# EAGLE design pedometer (EAGLE 9.6.2)
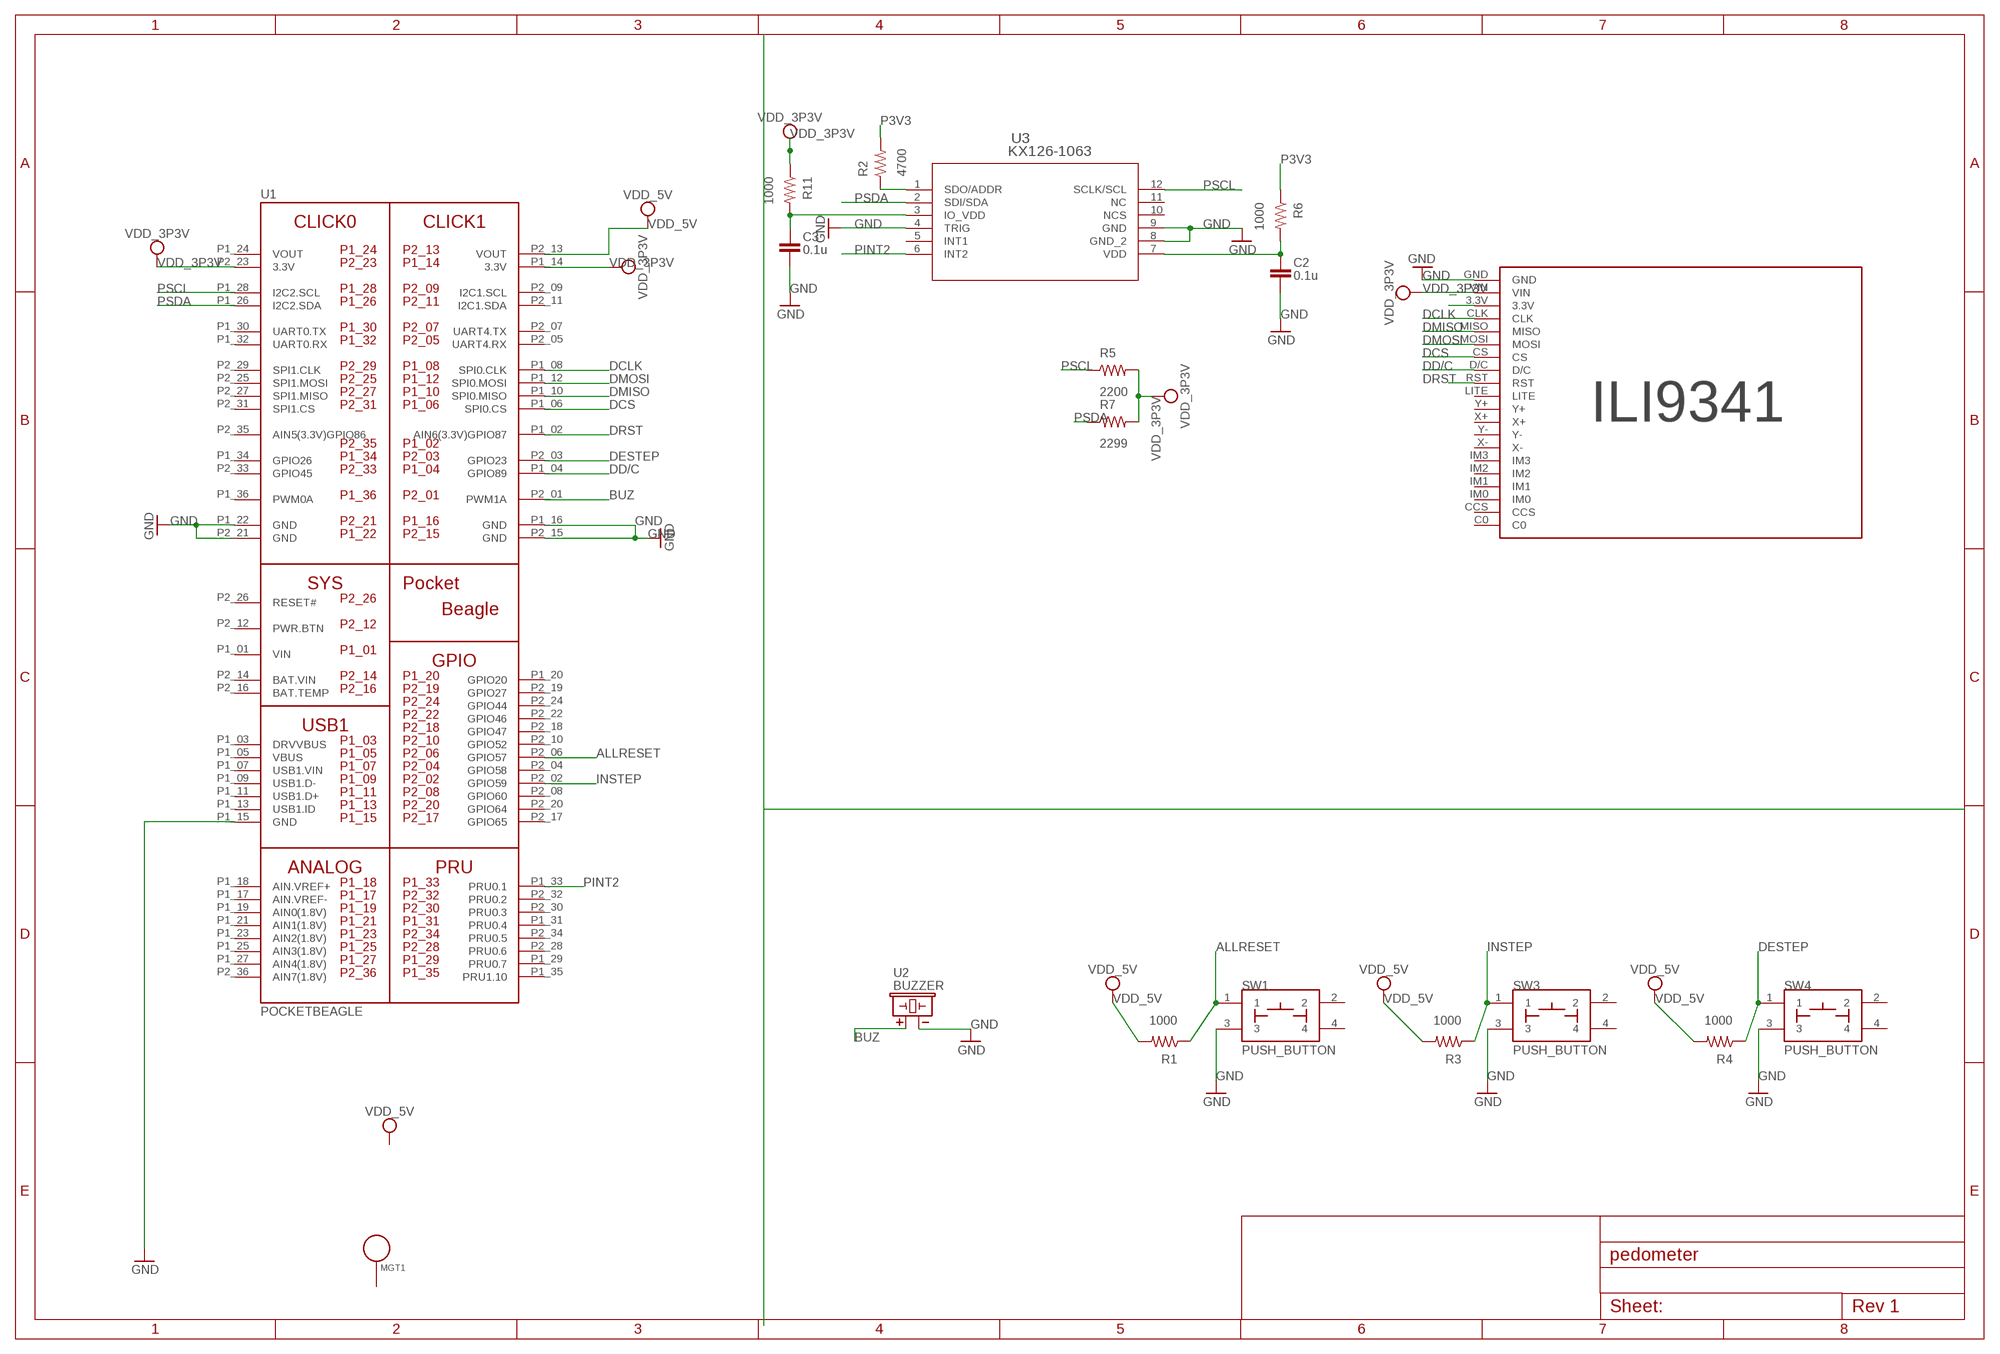
[diagram p0: schematic, sheet 1]

## Parts
B2  ILI9341  [ILI9341]
C2  0.1u  C_C0402  [C0402]
C3  0.1u  C_C0402  [C0402]
MGT1  MOUNTING_HOLE  [MOUNTING_HOLE]
R1  1000  R_R0805  [R0805]
R2  4700  R_R0603  [R0603]
R3  1000  R_R0805  [R0805]
R4  1000  R_R0805  [R0805]
R5  2200  R_R0603  [R0603]
R6  1000  R_R0603  [R0603]
R7  2299  R_R0603  [R0603]
R11  1000  R_R0603  [R0603]
SW1  PUSH_BUTTON  [BUTTON_12.5MM]
SW3  PUSH_BUTTON  [BUTTON_12.5MM]
SW4  PUSH_BUTTON  [BUTTON_12.5MM]
U1  POCKETBEAGLE  [POCKETBEAGLE]
U2  BUZZER  [BUZZER_6.5MM]
U3  KX126-1063  [LGA12_2X2X0P9_KNX]

## Nets
ALLRESET: R1.1 SW1.1 U1.P2_06(GPIO57)
BUZ: U1.P2_01(PWM1A) U2.+
DCLK: B2.CLK U1.P1_08(SPI0.CLK)
DCS: B2.CS U1.P1_06(SPI0.CS)
DD/C: B2.D/C U1.P1_04(GPIO89)
DESTEP: R4.1 SW4.1 U1.P2_03(GPIO23)
DMISO: B2.MISO U1.P1_10(SPI0.MISO)
DMOSI: B2.MOSI U1.P1_12(SPI0.MOSI)
DRST: B2.RST U1.P1_02(AIN6(3.3V)GPIO87)
GND: B2.GND C2.2 C3.2 SW1.3 SW3.3 SW4.3 U1.P1_15(GND) U1.P1_16(GND) U1.P1_22(GND) U1.P2_15(GND) U1.P2_21(GND) U2.- U3.4(TRIG) U3.8(GND_2) U3.9(GND)
INSTEP: R3.1 SW3.1 U1.P2_02(GPIO59)
N$2: C2.1 R6.2 U3.7(VDD)
N$3: C3.1 R11.2 U3.3(IO_VDD)
N$4: B2.3.3V
N$5: R2.1 U3.1(SDO/ADDR)
P3V3: R2.2 R6.1
PINT2: U1.P1_33(PRU0.1) U3.6(INT2)
PSCL: R5.1 U1.P1_28(I2C2.SCL) U3.12(SCLK/SCL)
PSDA: R7.1 U1.P1_26(I2C2.SDA) U3.2(SDI/SDA)
VDD_3P3V: B2.VIN R5.2 R7.2 R11.1 U1.P1_14(3.3V) U1.P2_23(3.3V)
VDD_5V: R1.2 R3.2 R4.2 U1.P2_13(VOUT)
Unconnected: B2.C0 B2.CCS B2.IM0 B2.IM1 B2.IM2 B2.IM3 B2.LITE B2.X+ B2.X- B2.Y+ B2.Y- MGT1.P$1 SW1.2 SW1.4 SW3.2 SW3.4 SW4.2 SW4.4 U1.P1_03(DRVVBUS) U1.P1_05(VBUS) U1.P1_07(USB1.VIN) U1.P1_09(USB1.D-) U1.P1_11(USB1.D+) U1.P1_13(USB1.ID) U1.P1_17(AIN.VREF-) U1.P1_18(AIN.VREF+) U1.P1_19(AIN0(1.8V)) U1.P1_20(GPIO20) U1.P1_21(AIN1(1.8V)) U1.P1_23(AIN2(1.8V)) U1.P1_25(AIN3(1.8V)) U1.P1_27(AIN4(1.8V)) U1.P1_29(PRU0.7) U1.P1_30(UART0.TX) U1.P1_31(PRU0.4) U1.P1_32(UART0.RX) U1.P1_34(GPIO26) U1.P1_35(PRU1.10) U1.P1_36(PWM0A) U1.P2_04(GPIO58) U1.P2_05(UART4.RX) U1.P2_07(UART4.TX) U1.P2_08(GPIO60) U1.P2_09(I2C1.SCL) U1.P2_10(GPIO52) U1.P2_11(I2C1.SDA) U1.P2_12(PWR.BTN) U1.P2_16(BAT.TEMP) U1.P2_17(GPIO65) U1.P2_18(GPIO47) U1.P2_19(GPIO27) U1.P2_20(GPIO64) U1.P2_22(GPIO46) U1.P2_24(GPIO44) U1.P2_25(SPI1.MOSI) U1.P2_26(RESET#) U1.P2_27(SPI1.MISO) U1.P2_28(PRU0.6) U1.P2_29(SPI1.CLK) U1.P2_30(PRU0.3) U1.P2_31(SPI1.CS) U1.P2_32(PRU0.2) U1.P2_33(GPIO45) U1.P2_34(PRU0.5) U1.P2_35(AIN5(3.3V)GPIO86) U1.P2_36(AIN7(1.8V)) U3.5(INT1) U3.10(NCS) U3.11(NC)

## Power pins joined to a net without a drawn wire
BAT.VIN: U1.P2_14(BAT.VIN)
VIN: U1.P1_01(VIN)
VOUT: U1.P1_24(VOUT)

## Library data of the parts
B2 = Juan_pedometer:ILI9341: ILI9341 LCD based on the 2.8" Adafruit product
C2 C3 = Juan_pedometer:C_: Capacitor SMD. Sizes: 0402, 0603 & 0805
MGT1 = Juan_pedometer:MOUNTING_HOLE: Chassis Mounting Hole w/GND connection ability
R1-R7 R11 = Juan_pedometer:R_: RESISTOR, American symbol
SW1 SW3 SW4 = Juan_pedometer:PUSH_BUTTON
U1 = Juan_pedometer:POCKETBEAGLE
U2 = Juan_pedometer:BUZZER: CEM-1203 Buzzer
U3 = Juan_pedometer:KX126-1063; COPYRIGHT: Copyright (C) 2021 Ultra Librarian. All rights reserved.; DIGI-KEY_PART_NUMBER_1: 1191-1058-2-ND; DIGI-KEY_PART_NUMBER_2: 1191-1058-1-ND; DIGI-KEY_PART_NUMBER_3: 1191-1058-6-ND; MANUFACTURER_PART_NUMBER: KX126-1063; MFR_NAME: Kionix

## Board
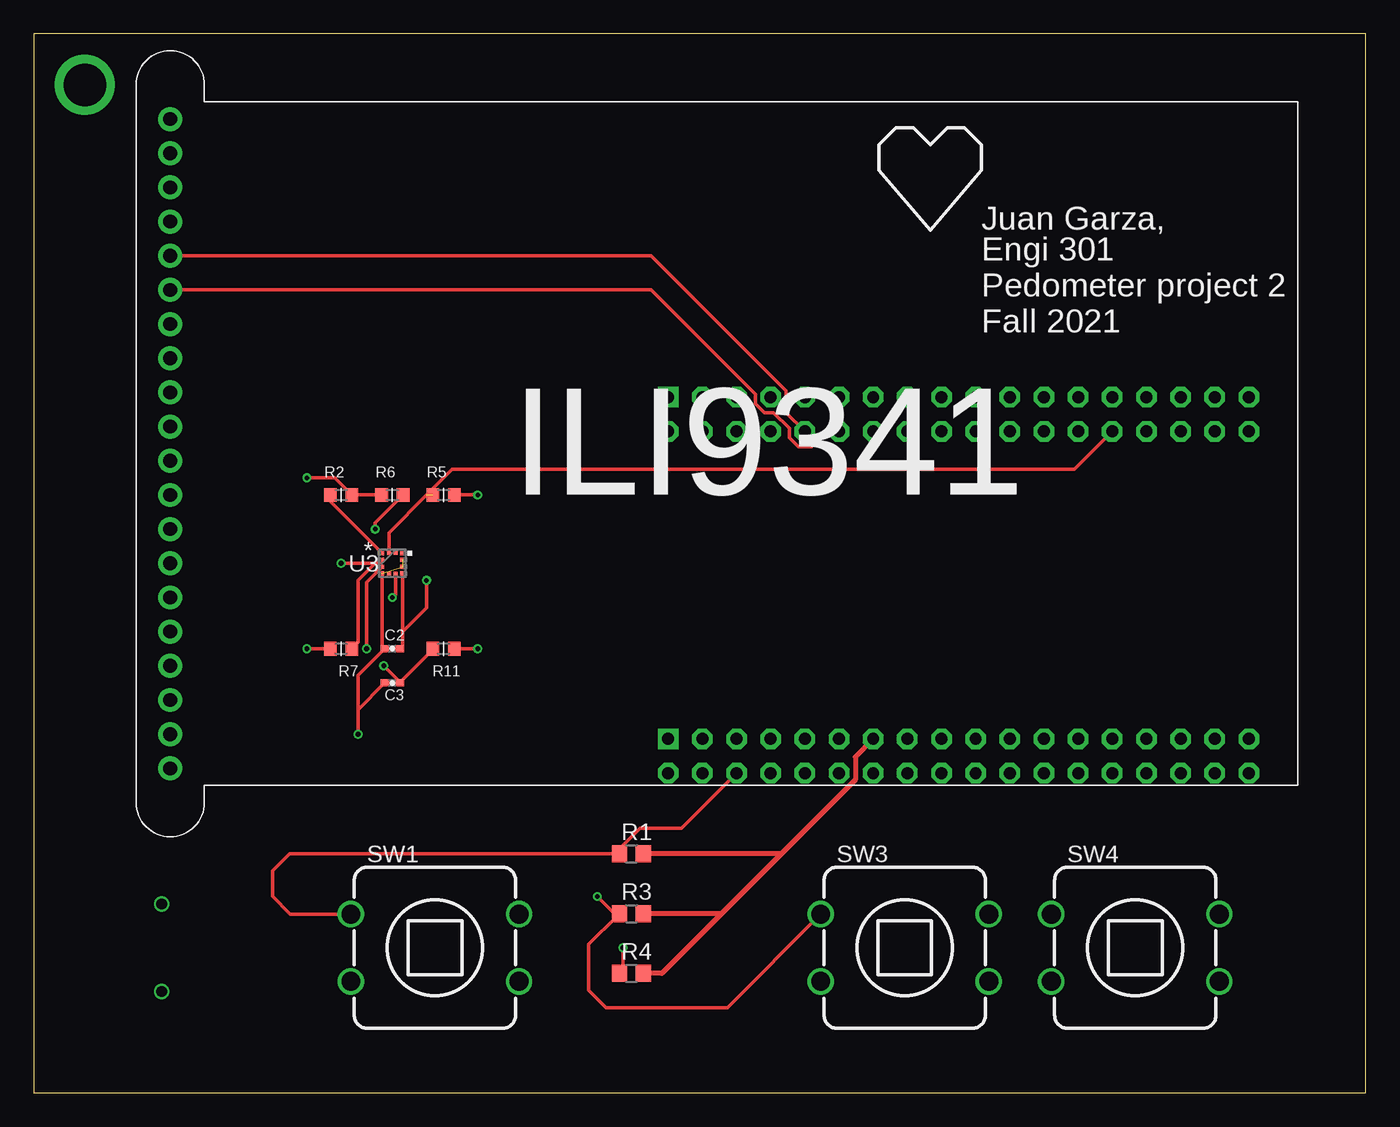
[diagram p1: board, top side]
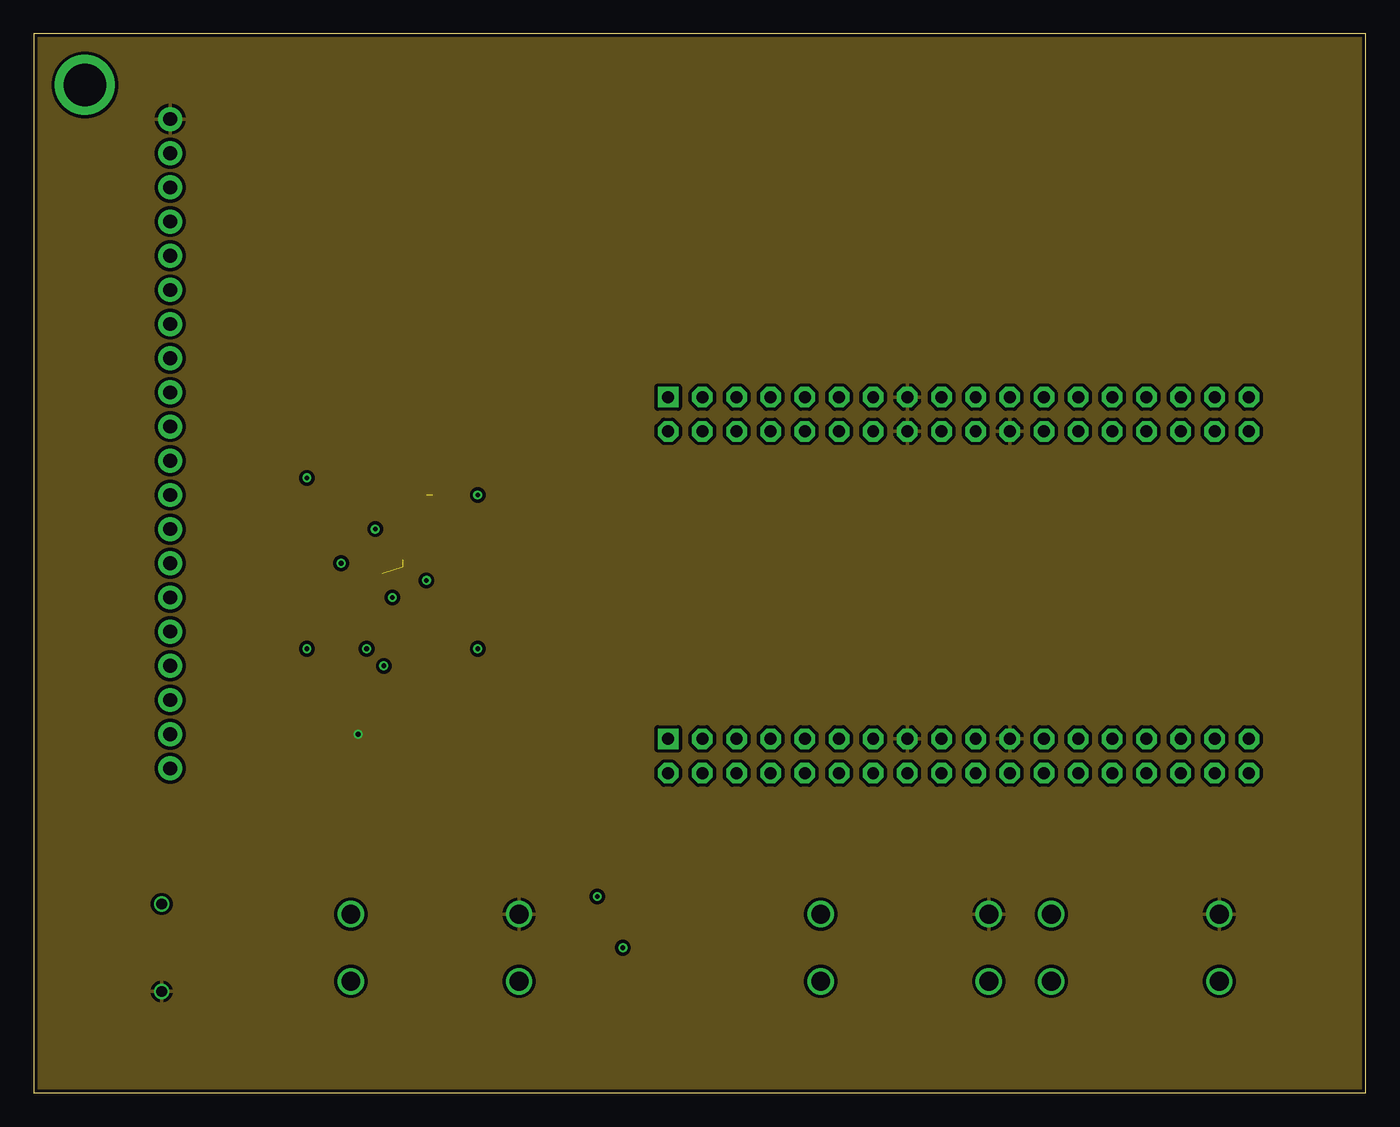
[diagram p2: board, inner layer Route2]
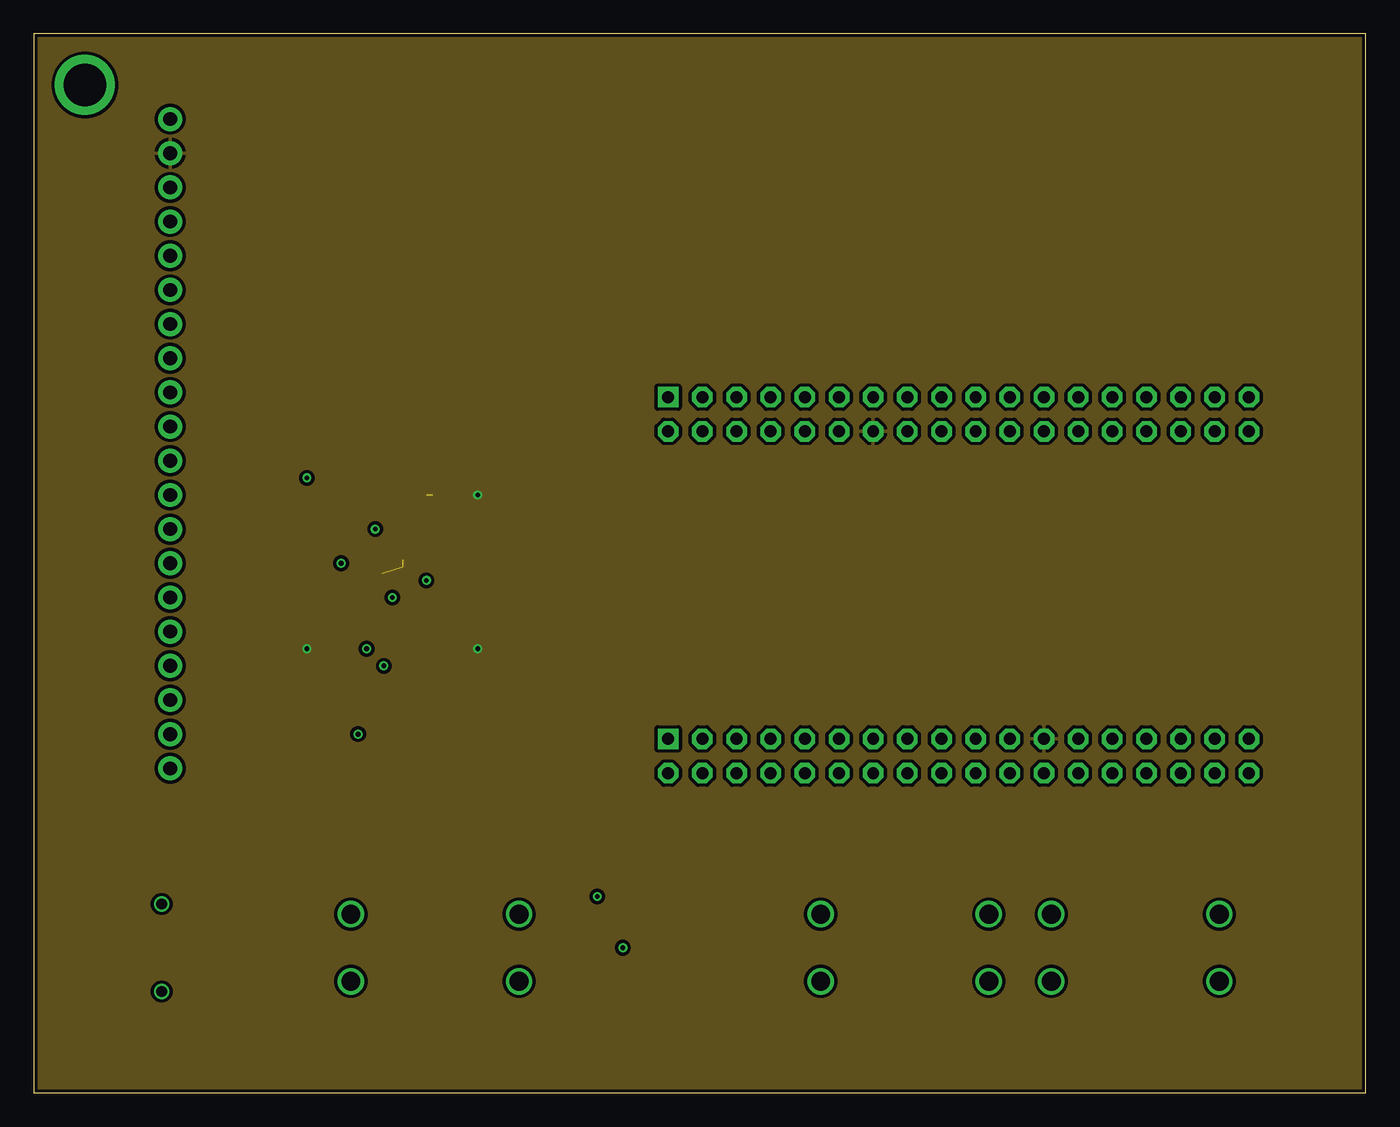
[diagram p3: board, inner layer Route15]
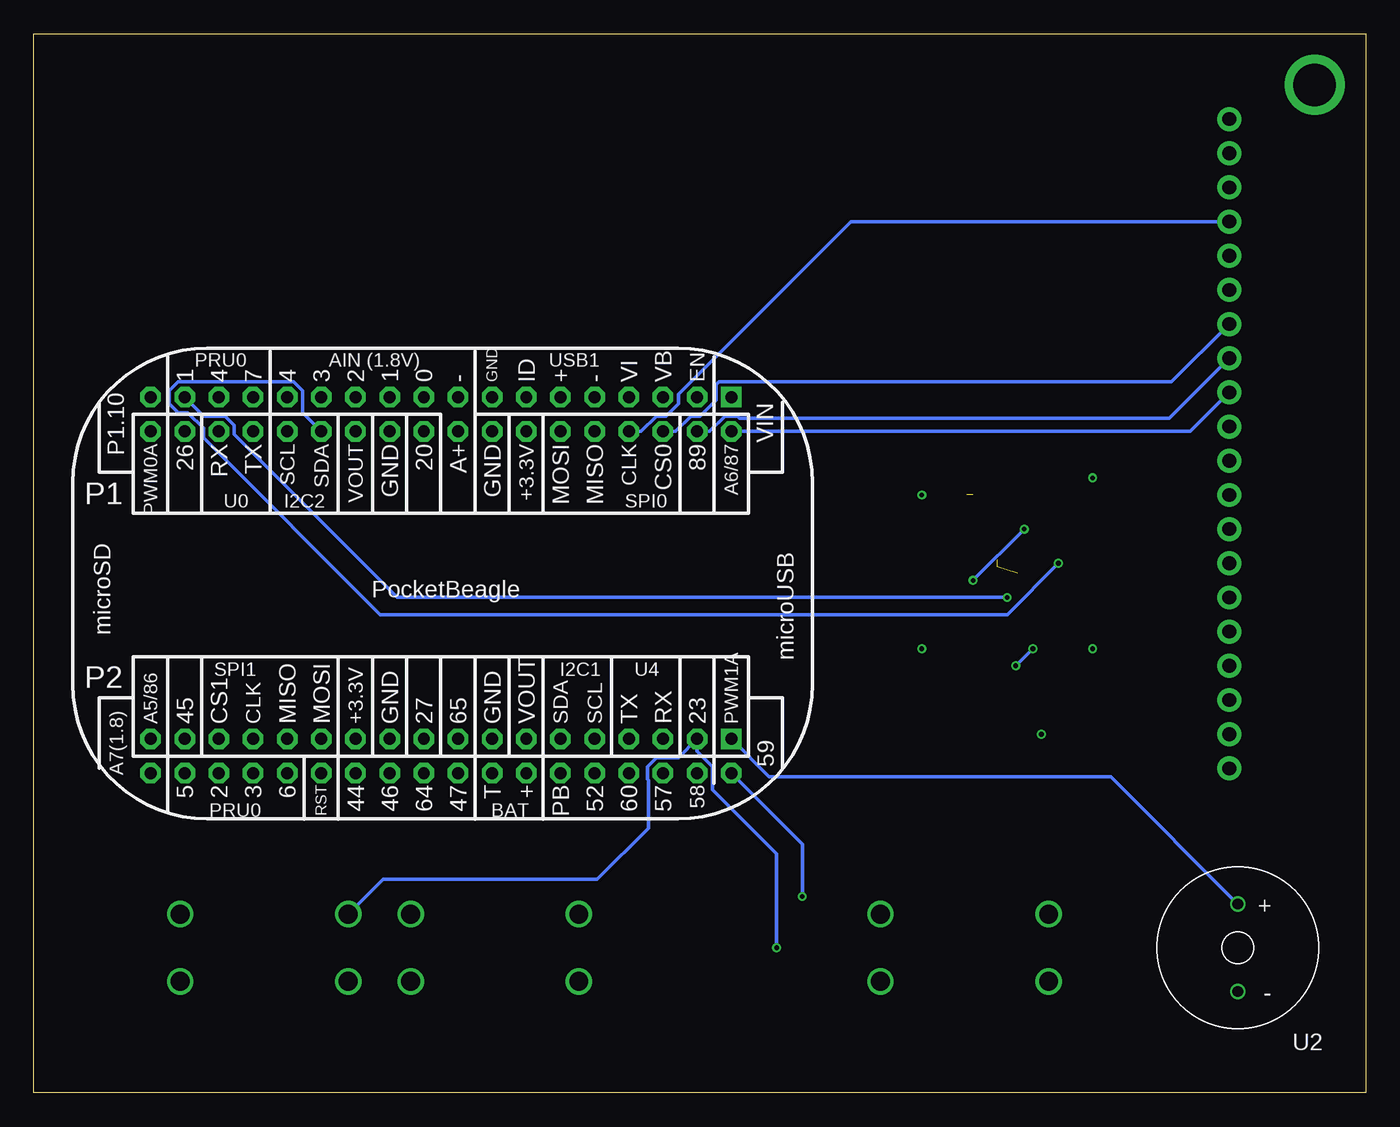
[diagram p4: board, bottom side, seen from below]

Size 99.06 x 78.74 mm. Coordinates in mm from the lower left corner, seen from the top.
Outline: 0,0 99.06,0 99.06,78.74 0,78.74 0,0
Copper layers (1*2*15*16): Top 0.035mm / dielectric 0.23mm / Route2 0.035mm / dielectric 0.93mm / Route15 0.035mm / dielectric 0.23mm / Bottom 0.035mm
Design rules "ENGI301_4lyr *": minimum track width 10mil, minimum drill 12mil, track to track 10mil, track to pad 10mil, pad to pad 10mil, via to via 10mil, smd to smd 10mil, copper to edge 10mil, drill to drill 12mil, minimum pad ring 6mil, minimum via ring 6mil, stop-mask expansion 3mil, vias tented up to drill 25mil, thermal gap 10mil

### Footprints (pad centres in the part's own frame; a part is rotated, then mirrored left to right if it is on the bottom)
ILI9341 = drill 1.016 pad 1.778: 3.3V 0,-5.08; C0 0,-48.26; CCS 0,-45.72; CLK 0,-7.62; CS 0,-15.24; D/C 0,-17.78; GND 0,0; IM0 0,-43.18; IM1 0,-40.64; IM2 0,-38.1; IM3 0,-35.56; LITE 0,-22.86; MISO 0,-10.16; MOSI 0,-12.7; RST 0,-20.32; VIN 0,-2.54; X+ 0,-27.94; X- 0,-33.02; Y+ 0,-25.4; Y- 0,-30.48
C0402 = smd 0.61 x 0.508: 1 -0.559,0; 2 0.559,0
MOUNTING_HOLE = drill 3.175 pad 4.445: P$1 0,0
R0805 = smd 1.143 x 1.27: 1 -0.889,0; 2 0.889,0
R0603 = smd 0.95 x 1.031: 1 -0.8,0; 2 0.8,0
BUTTON_12.5MM = drill 1.4: 1 -6.25,2.5; 2 -6.25,-2.5; 3 6.25,2.5; 4 6.25,-2.5
POCKETBEAGLE = drill 0.889 pad 1.524 square: P1_01 5.91,3.53; P2_01 5.91,28.93 | drill 0.889 pad 1.524 octagon: P1_02 5.91,6.07; P1_03 8.45,3.53; P1_04 8.45,6.07; P1_05 10.99,3.53; P1_06 10.99,6.07; P1_07 13.53,3.53; P1_08 13.53,6.07; P1_09 16.07,3.53; P1_10 16.07,6.07; P1_11 18.61,3.53; P1_12 18.61,6.07; P1_13 21.15,3.53; P1_14 21.15,6.07; P1_15 23.69,3.53; P1_16 23.69,6.07; P1_17 26.23,3.53; P1_18 26.23,6.07; P1_19 28.77,3.53; P1_20 28.77,6.07; P1_21 31.31,3.53; P1_22 31.31,6.07; P1_23 33.85,3.53; P1_24 33.85,6.07; P1_25 36.39,3.53; P1_26 36.39,6.07; P1_27 38.93,3.53; P1_28 38.93,6.07; P1_29 41.47,3.53; P1_30 41.47,6.07; P1_31 44.01,3.53; P1_32 44.01,6.07; P1_33 46.55,3.53; P1_34 46.55,6.07; P1_35 49.09,3.53; P1_36 49.09,6.07; P2_02 5.91,31.47; P2_03 8.45,28.93; P2_04 8.45,31.47; P2_05 10.99,28.93; P2_06 10.99,31.47; P2_07 13.53,28.93; P2_08 13.53,31.47; P2_09 16.07,28.93; P2_10 16.07,31.47; P2_11 18.61,28.93; P2_12 18.61,31.47; P2_13 21.15,28.93; P2_14 21.15,31.47; P2_15 23.69,28.93; P2_16 23.69,31.47; P2_17 26.23,28.93; P2_18 26.23,31.47; P2_19 28.77,28.93; P2_20 28.77,31.47; P2_21 31.31,28.93; P2_22 31.31,31.47; P2_23 33.85,28.93; P2_24 33.85,31.47; P2_25 36.39,28.93; P2_26 36.39,31.47; P2_27 38.93,28.93; P2_28 38.93,31.47; P2_29 41.47,28.93; P2_30 41.47,31.47; P2_31 44.01,28.93; P2_32 44.01,31.47; P2_33 46.55,28.93; P2_34 46.55,31.47; P2_35 49.09,28.93; P2_36 49.09,31.47
BUZZER_6.5MM = drill 0.8: + 0,-3.25; - 0,3.25
LGA12_2X2X0P9_KNX = smd 0.33 x 0.305: 1 -0.762,0.75; 2 -0.762,0.25; 3 -0.762,-0.25; 4 -0.762,-0.75; 7 0.762,-0.75; 8 0.762,-0.25; 9 0.762,0.25; 10 0.762,0.75 | smd 0.305 x 0.33: 5 -0.25,-0.787; 6 0.25,-0.787; 11 0.25,0.787; 12 -0.25,0.787

### Placement (x,y rotation side)
B2  10.16,72.39 0 top
C2  26.67,33.02 180 top
C3  26.67,30.48 180 top
MGT1  3.81,74.93 0 top
R1  44.45,17.78 0 top
R2  22.86,44.45 0 top
R3  44.45,13.34 0 top
R4  44.45,8.89 0 top
R5  30.48,44.45 0 top
R6  26.67,44.45 0 top
R7  22.86,33.02 180 top
R11  30.48,33.02 180 top
SW1  29.84,10.79 0 top
SW3  64.77,10.79 0 top
SW4  81.92,10.79 0 top
U1  41.27,55.24 180 bottom
U2  9.53,10.79 180 bottom
U3  26.67,39.37 0 top

### Tracks (layer width: path | path; a pad name or v marks a point on that pad's centre or on a via)
ALLRESET
  Top 0.254: SW1.1 19.09,13.29 17.78,14.61 17.78,16.51 19.05,17.78 R1.1 43.56,18.16 45.09,19.68 48.17,19.68 U1.P2_06
BUZ
  Bottom 0.254: U1.P2_01 44.37,23.5 18.98,23.5 U2.+
DCLK
  Bottom 0.254: B2.CLK 38.29,64.77 51.12,51.93 51.12,51.24 52.05,50.32 52.74,50.32 53.88,49.17 U1.P1_08
DCS
  Bottom 0.254: U1.P1_06 51.34,49.17 50.2,50.32 49.51,50.32 48.33,51.5 48.33,52.63 48.1,52.86 14.45,52.86 B2.CS
DD/C
  Bottom 0.254: U1.P1_04 48.8,49.17 47.66,50.32 46.71,50.32 46.56,50.16 14.61,50.16 B2.D/C
DESTEP  (via drill 0.35)
  Top 0.254: v43.81,10.79 43.81,9.14 R4.1
  Bottom 0.254: v43.81,10.79 43.81,17.78 48.58,22.55 48.58,24.25 49.73,25.39 U1.P2_03 51.12,24.92 52.74,24.92 53.41,24.25 53.41,23.3 53.34,23.23 53.34,19.68 57.15,15.88 73.08,15.88 SW4.1
DMISO
  Top 0.254: U1.P1_10 55.95,50.57 55.95,52.19 45.91,62.23 B2.MISO
DMOSI
  Top 0.254: B2.MOSI 45.91,59.69 53.66,51.93 53.66,51.24 54.33,50.57 55.02,50.57 56.2,49.39 56.2,48.7 56.87,48.03 57.82,48.03 58.96,49.17 U1.P1_12
DRST
  Bottom 0.254: U1.P1_02 13.05,49.17 B2.RST
GND  (via drill 0.35)  (2 unrouted)
  Top 0.254: C3.2 24.13,28.5 | 24.13,28.5 v24.13,26.67 | 24.13,28.5 24.13,31.04 C2.2 25.91,33.22 U3.4
  pour Route2: -2.54,81.28 101.6,81.28 101.6,-2.54 -2.54,-2.54
INSTEP  (via drill 0.35)
  Top 0.254: R3.1 43.37,13.14 | 43.37,13.14 41.27,11.05 41.27,7.62 42.55,6.35 51.58,6.35 SW3.1 | v41.91,14.61 43.37,13.14
  Bottom 0.254: U1.P2_02 41.91,18.5 v41.91,14.61
N$2  (via drill 0.35)
  Top 0.254: U3.7 27.43,34.29 | 27.43,34.29 27.43,33.22 C2.1 | R6.2 25.4,42.38 v25.4,41.91 | 27.43,34.29 29.21,36.07 v29.21,38.1
  Bottom 0.254: v25.4,41.91 v29.21,38.1
N$3  (via drill 0.35)
  Top 0.254: U3.3 24.77,37.98 v24.77,33.02 | v26.04,31.75 27.23,30.56 C3.1 29.68,32.93 R11.2
  Bottom 0.254: v24.77,33.02 v26.04,31.75
N$5
  Top 0.254: U3.1 22.06,43.97 R2.1
P3V3  (via drill 0.35)
  Top 0.254: R6.1 R2.2 22.39,45.72 v20.32,45.72
PINT2  (via drill 0.35)
  Top 0.254: U3.6 26.92,37.08 v26.67,36.83
  Bottom 0.254: U1.P1_33 86.43,50.32 84.81,50.32 84.14,49.65 84.14,48.96 72.02,36.83 v26.67,36.83
PSCL  (1 unrouted)
  Top 0.254: U3.12 26.42,41.66 29.21,44.45 | U1.P1_28 77.39,46.35 31.11,46.35 29.68,44.92 R5.1
PSDA  (via drill 0.35)
  Top 0.254: R7.1 24.13,33.49 24.13,38.1 25.4,39.37 | U3.2 25.66,39.37 25.4,39.37 | 25.4,39.37 v22.86,39.37
  Bottom 0.254: v22.86,39.37 26.67,35.56 73.29,35.56 86.43,48.7 86.43,49.39 87.61,50.57 88.3,50.57 88.97,51.24 88.97,52.19 88.3,52.86 79.73,52.86 79.06,52.19 79.06,50.57 U1.P1_26
VDD_3P3V  (via drill 0.35)
  Top 0.254: R7.2 v20.32,33.02 | R11.1 v33.02,33.02 | R5.2 v33.02,44.45
  pour Route15: -5.08,83.82 104.14,83.82 104.14,-5.08 -5.08,-5.08
VDD_5V
  Top 0.381: U1.P2_13 61.09,24.98 61.09,23.27 55.6,17.78 | 55.6,17.78 R1.2 | 55.6,17.78 51.29,13.48 51.15,13.34 | 51.15,13.34 R3.2 | 51.15,13.34 46.71,8.89 R4.2

### Text on the board
tPlace: Juan Garza, | Engi 301 / Pedometer project 2 / Fall 2021